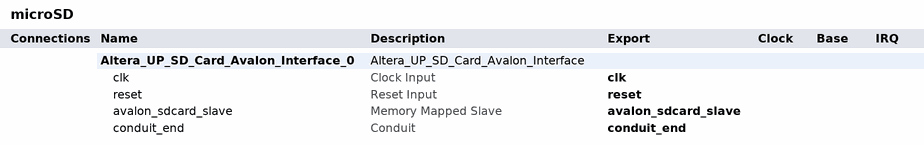
[diagram p0: system contents]
# Platform Designer (Qsys) system microSD, Cyclone V 5CSEMA5F31C6
# Parameters at their usual value, and those the tool derives, are not listed.
package require qsys
create_system microSD
set_project_property DEVICE_FAMILY {Cyclone V}
set_project_property DEVICE 5CSEMA5F31C6

add_instance Altera_UP_SD_Card_Avalon_Interface_0 Altera_UP_SD_Card_Avalon_Interface 17.1
set_instance_property Altera_UP_SD_Card_Avalon_Interface_0 AUTO_EXPORT true

# exported interfaces
add_interface avalon_sdcard_slave avalon slave
set_interface_property avalon_sdcard_slave EXPORT_OF Altera_UP_SD_Card_Avalon_Interface_0.avalon_sdcard_slave
add_interface clk clock sink
set_interface_property clk EXPORT_OF Altera_UP_SD_Card_Avalon_Interface_0.clk
add_interface conduit_end conduit end
set_interface_property conduit_end EXPORT_OF Altera_UP_SD_Card_Avalon_Interface_0.conduit_end
add_interface reset reset sink
set_interface_property reset EXPORT_OF Altera_UP_SD_Card_Avalon_Interface_0.reset

set_interconnect_requirement {$system} qsys_mm.clockCrossingAdapter HANDSHAKE
set_interconnect_requirement {$system} qsys_mm.enableEccProtection FALSE
set_interconnect_requirement {$system} qsys_mm.insertDefaultSlave FALSE
set_interconnect_requirement {$system} qsys_mm.maxAdditionalLatency 1

save_system microSD.qsys
